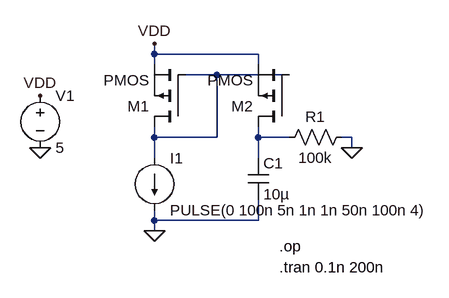
[diagram p0: schematic integrator.asc]
integrator.asc, the LTspice schematic file:
Version 4
SHEET 1 944 680
WIRE 512 336 512 320
WIRE 672 336 512 336
WIRE 512 352 512 336
WIRE 672 352 672 336
WIRE 608 368 560 368
WIRE 720 368 608 368
WIRE 512 464 512 448
WIRE 608 464 608 368
WIRE 608 464 512 464
WIRE 672 464 672 448
WIRE 720 464 672 464
WIRE 816 464 800 464
WIRE 816 480 816 464
WIRE 512 496 512 464
WIRE 672 496 672 464
WIRE 512 592 512 576
WIRE 672 592 672 560
WIRE 672 592 512 592
WIRE 512 608 512 592
FLAG 336 480 0
FLAG 336 400 VDD
FLAG 512 608 0
FLAG 512 320 VDD
FLAG 816 480 0
SYMBOL current 512 496 R0
SYMATTR InstName I1
SYMATTR Value PULSE(0 100n 5n 1n 1n 50n 100n 4)
SYMBOL Voltage 336 384 R0
SYMATTR InstName V1
SYMATTR Value 5
SYMBOL pmos 560 448 R180
SYMATTR InstName M1
SYMBOL pmos 720 448 R180
SYMATTR InstName M2
SYMBOL Cap 656 496 R0
SYMATTR InstName C1
SYMATTR Value 10µ
SYMBOL Res 816 448 R90
WINDOW 0 0 56 VBottom 2
WINDOW 3 32 56 VTop 2
SYMATTR InstName R1
SYMATTR Value 100k
TEXT 704 632 Left 2 !.op
TEXT 704 664 Left 2 !.tran 0.1n 200n

The netlist it stands for:
* integrator.asc
I1 N001 0 PULSE(0 100n 5n 1n 1n 50n 100n 4)
V1 VDD 0 5
M1 N001 N001 VDD VDD PMOS
M2 N002 N001 VDD VDD PMOS
C1 N002 0 10µ
R1 0 N002 100k
.model NMOS NMOS
.model PMOS PMOS
.lib standard.mos
.op
.tran 0.1n 200n
.backanno
.end